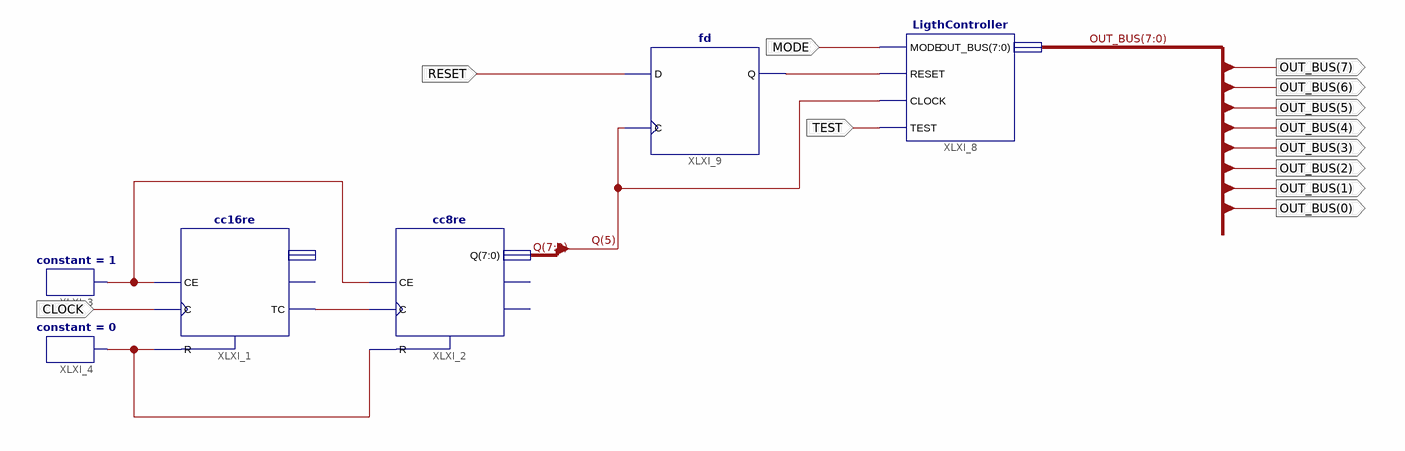
[diagram p0: schematic sheet 1]
// Xilinx ISE schematic TopLevel.sch (spartan3a) as structural Verilog: 6 symbols, 12 ports
module TopLevel (
  input  MODE,
  input  TEST,
  input  RESET,
  input  CLOCK,
  output [7:0] OUT_BUS
);

  wire XLXN_1, XLXN_2, XLXN_4, XLXN_26;
  wire [7:0] Q;

  cc8re XLXI_2 (.C(XLXN_4), .CE(XLXN_1), .R(XLXN_2), .Q(Q));  // open: CEO, TC
  fd XLXI_9 (.C(Q[5]), .D(RESET), .Q(XLXN_26));
  LigthController XLXI_8 (.MODE(MODE), .RESET(XLXN_26), .CLOCK(Q[5]), .TEST(TEST), .OUT_BUS(OUT_BUS));
  cc16re XLXI_1 (.C(CLOCK), .CE(XLXN_1), .R(XLXN_2), .TC(XLXN_4));  // open: CEO, Q
  constant #(.CValue("1")) XLXI_3 (.O(XLXN_1));
  constant #(.CValue("0")) XLXI_4 (.O(XLXN_2));
endmodule
